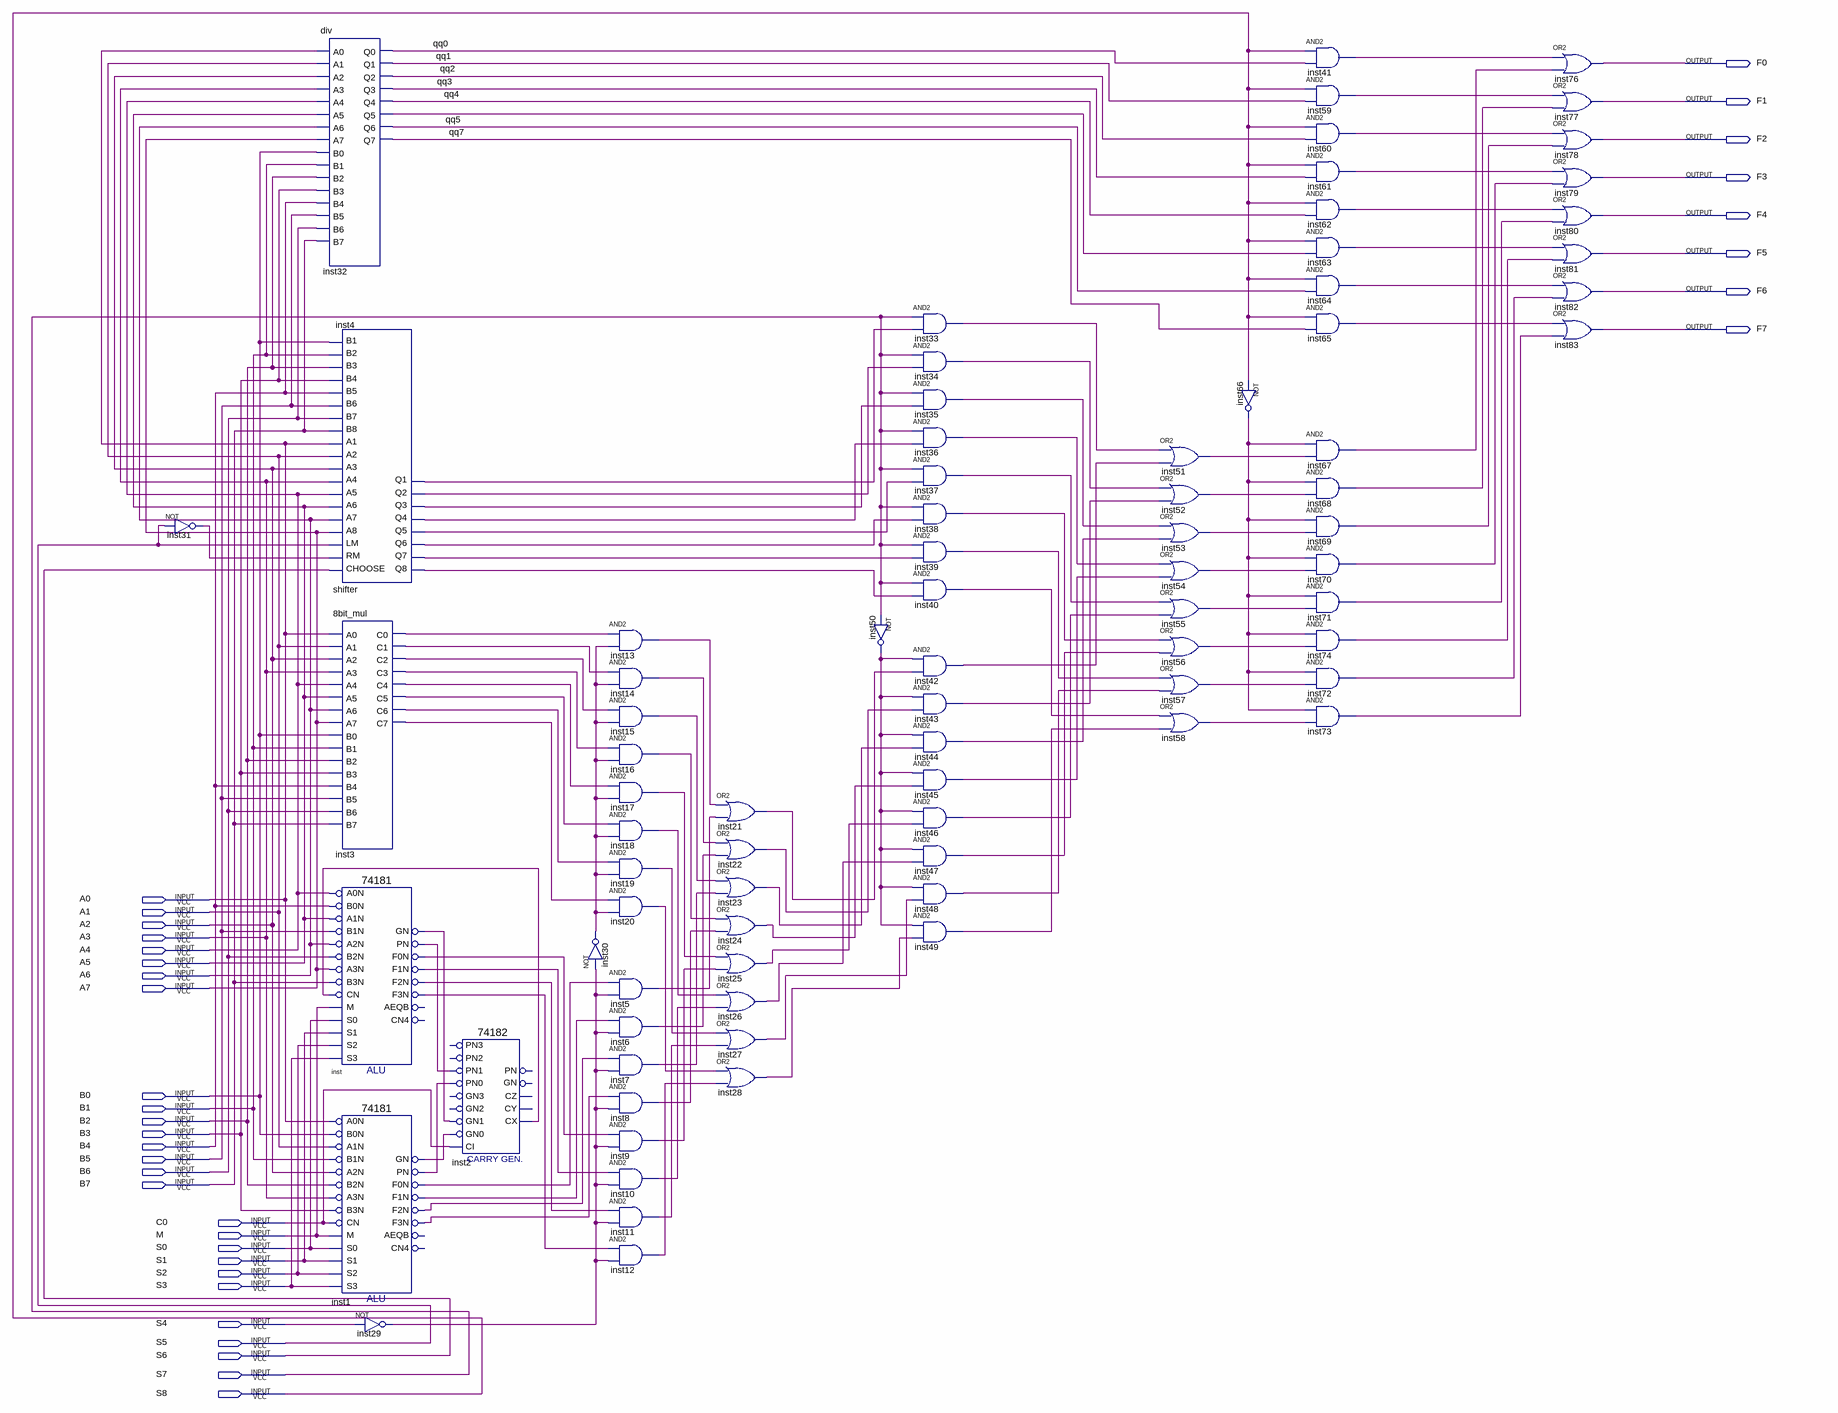
[diagram p0: schematic sheet]
// Quartus schematic ALUnew.bdf as structural Verilog: 83 symbols, 35 pins
module ALUnew (
  input  A0,
  input  A1,
  input  A2,
  input  A3,
  input  A4,
  input  A5,
  input  A6,
  input  A7,
  input  B0,
  input  B1,
  input  B2,
  input  B3,
  input  B4,
  input  B5,
  input  B6,
  input  B7,
  input  C0,
  input  M,
  input  S0,
  input  S1,
  input  S2,
  input  S3,
  input  S4,
  input  S5,
  input  S6,
  input  S7,
  input  S8,
  output F0,
  output F1,
  output F2,
  output F3,
  output F4,
  output F5,
  output F6,
  output F7
);

  wire inst1_f0n, inst1_f1n, inst1_f2n, inst1_f3n, inst1_gn, inst1_pn, inst2_cx, inst3_c0, inst3_c1,
       inst3_c2, inst3_c3, inst3_c4, inst3_c5, inst3_c6, inst3_c7, inst4_q1, inst4_q2, inst4_q3, inst4_q4,
       inst4_q5, inst4_q6, inst4_q7, inst4_q8, inst5_out, inst6_out, inst7_out, inst8_out, inst9_out,
       inst10_out, inst11_out, inst12_out, inst13_out, inst14_out, inst15_out, inst16_out, inst17_out,
       inst18_out, inst19_out, inst20_out, inst21_out, inst22_out, inst23_out, inst24_out, inst25_out,
       inst26_out, inst27_out, inst28_out, inst29_out, inst30_out, inst31_out, inst32_q5, inst33_out,
       inst34_out, inst35_out, inst36_out, inst37_out, inst38_out, inst39_out, inst40_out, inst41_out,
       inst42_out, inst43_out, inst44_out, inst45_out, inst46_out, inst47_out, inst48_out, inst49_out,
       inst50_out, inst51_out, inst52_out, inst53_out, inst54_out, inst55_out, inst56_out, inst57_out,
       inst58_out, inst59_out, inst60_out, inst61_out, inst62_out, inst63_out, inst64_out, inst65_out,
       inst66_out, inst67_out, inst68_out, inst69_out, inst70_out, inst71_out, inst72_out, inst73_out,
       inst74_out, inst_f0n, inst_f1n, inst_f2n, inst_f3n, inst_gn, inst_pn, qq0, qq1, qq2, qq3, qq4, qq5,
       qq7;

  not inst31 (inst31_out, S5);
  div inst32 (
    .A0(A0), .A1(A1), .A2(A2), .A3(A3), .A4(A4), .A5(A5), .A6(A6), .A7(A7), .B0(B0), .B1(B1), .B2(B2),
    .B3(B3), .B4(B4), .B5(B5), .B6(B6), .B7(B7), .Q0(qq0), .Q1(qq1), .Q2(qq2), .Q3(qq3), .Q4(qq4),
    .Q5(inst32_q5), .Q6(qq5), .Q7(qq7));
  shifter inst4 (
    .CHOOSE(S6), .RM(inst31_out), .LM(S5), .A8(A7), .A7(A6), .A6(A5), .A5(A4), .A4(A3), .A3(A2), .A2(A1),
    .A1(A0), .B8(B7), .B7(B6), .B6(B5), .B5(B4), .B4(B3), .B3(B2), .B2(B1), .B1(B0), .Q8(inst4_q8),
    .Q7(inst4_q7), .Q6(inst4_q6), .Q5(inst4_q5), .Q4(inst4_q4), .Q3(inst4_q3), .Q2(inst4_q2), .Q1(inst4_q1));
  \8bit_mul  inst3 (
    .A0(A0), .A1(A1), .A2(A2), .A3(A3), .A4(A4), .A5(A5), .A6(A6), .A7(A7), .B0(B0), .B1(B1), .B2(B2),
    .B3(B3), .B4(B4), .B5(B5), .B6(B6), .B7(B7), .C0(inst3_c0), .C1(inst3_c1), .C2(inst3_c2), .C3(inst3_c3),
    .C4(inst3_c4), .C5(inst3_c5), .C6(inst3_c6), .C7(inst3_c7));
  \74181  inst (
    .B0N(B4), .A0N(A4), .A1N(A5), .B1N(B5), .A3N(A7), .B2N(B6), .A2N(A6), .M(M), .CN(inst2_cx), .B3N(B7),
    .S2(S2), .S1(S1), .S0(S0), .S3(S3), .PN(inst_pn), .GN(inst_gn), .F3N(inst_f3n), .F1N(inst_f1n),
    .F0N(inst_f0n), .F2N(inst_f2n));  // open: AEQB, CN4
  \74181  inst1 (
    .B0N(B0), .A0N(A0), .A1N(A1), .B1N(B1), .A3N(A3), .B2N(B2), .A2N(A2), .M(M), .CN(C0), .B3N(B3), .S2(S2),
    .S1(S1), .S0(S0), .S3(S3), .PN(inst1_pn), .GN(inst1_gn), .F3N(inst1_f3n), .F1N(inst1_f1n),
    .F0N(inst1_f0n), .F2N(inst1_f2n));  // open: AEQB, CN4
  not inst29 (inst29_out, S4);
  \74182  inst2 (
    .CI(C0), .PN1(inst_pn), .PN0(inst1_pn), .GN1(inst_gn), .GN0(inst1_gn), .CX(inst2_cx));  // open: PN2, GN2, GN3, PN3, CY, PN, CZ, GN
  and inst13 (inst13_out, inst3_c0, inst30_out);
  and inst14 (inst14_out, inst3_c1, inst30_out);
  and inst15 (inst15_out, inst3_c2, inst30_out);
  and inst16 (inst16_out, inst3_c3, inst30_out);
  and inst17 (inst17_out, inst3_c4, inst30_out);
  and inst18 (inst18_out, inst3_c5, inst30_out);
  and inst19 (inst19_out, inst3_c6, inst30_out);
  and inst20 (inst20_out, inst3_c7, inst30_out);
  not inst30 (inst30_out, inst29_out);
  and inst5 (inst5_out, inst1_f0n, inst29_out);
  and inst6 (inst6_out, inst1_f1n, inst29_out);
  and inst7 (inst7_out, inst1_f2n, inst29_out);
  and inst8 (inst8_out, inst1_f3n, inst29_out);
  and inst9 (inst9_out, inst_f0n, inst29_out);
  and inst10 (inst10_out, inst_f1n, inst29_out);
  and inst11 (inst11_out, inst_f2n, inst29_out);
  and inst12 (inst12_out, inst_f3n, inst29_out);
  or inst21 (inst21_out, inst13_out, inst5_out);
  or inst22 (inst22_out, inst14_out, inst6_out);
  or inst23 (inst23_out, inst15_out, inst7_out);
  or inst24 (inst24_out, inst16_out, inst8_out);
  or inst25 (inst25_out, inst17_out, inst9_out);
  or inst26 (inst26_out, inst18_out, inst10_out);
  or inst27 (inst27_out, inst19_out, inst11_out);
  or inst28 (inst28_out, inst20_out, inst12_out);
  not inst50 (inst50_out, S7);
  and inst33 (inst33_out, S7, inst4_q1);
  and inst34 (inst34_out, S7, inst4_q2);
  and inst35 (inst35_out, S7, inst4_q3);
  and inst36 (inst36_out, S7, inst4_q4);
  and inst37 (inst37_out, S7, inst4_q5);
  and inst38 (inst38_out, S7, inst4_q6);
  and inst39 (inst39_out, S7, inst4_q7);
  and inst40 (inst40_out, S7, inst4_q8);
  and inst42 (inst42_out, inst50_out, inst21_out);
  and inst43 (inst43_out, inst50_out, inst22_out);
  and inst44 (inst44_out, inst50_out, inst23_out);
  and inst45 (inst45_out, inst50_out, inst24_out);
  and inst46 (inst46_out, inst50_out, inst25_out);
  and inst47 (inst47_out, inst50_out, inst26_out);
  and inst48 (inst48_out, inst50_out, inst27_out);
  and inst49 (inst49_out, inst50_out, inst28_out);
  or inst51 (inst51_out, inst33_out, inst42_out);
  or inst52 (inst52_out, inst34_out, inst43_out);
  or inst53 (inst53_out, inst35_out, inst44_out);
  or inst54 (inst54_out, inst36_out, inst45_out);
  or inst55 (inst55_out, inst37_out, inst46_out);
  or inst56 (inst56_out, inst38_out, inst47_out);
  or inst57 (inst57_out, inst39_out, inst48_out);
  or inst58 (inst58_out, inst40_out, inst49_out);
  not inst66 (inst66_out, S8);
  and inst41 (inst41_out, S8, qq0);
  and inst59 (inst59_out, S8, qq1);
  and inst60 (inst60_out, S8, qq2);
  and inst61 (inst61_out, S8, qq3);
  and inst62 (inst62_out, S8, qq4);
  and inst63 (inst63_out, S8, inst32_q5);
  and inst64 (inst64_out, S8, qq5);
  and inst65 (inst65_out, S8, qq7);
  and inst67 (inst67_out, inst66_out, inst51_out);
  and inst68 (inst68_out, inst66_out, inst52_out);
  and inst69 (inst69_out, inst66_out, inst53_out);
  and inst70 (inst70_out, inst66_out, inst54_out);
  and inst71 (inst71_out, inst66_out, inst55_out);
  and inst74 (inst74_out, inst66_out, inst56_out);
  and inst72 (inst72_out, inst66_out, inst57_out);
  and inst73 (inst73_out, inst66_out, inst58_out);
  or inst76 (F0, inst41_out, inst67_out);
  or inst77 (F1, inst59_out, inst68_out);
  or inst78 (F2, inst60_out, inst69_out);
  or inst79 (F3, inst61_out, inst70_out);
  or inst80 (F4, inst62_out, inst71_out);
  or inst81 (F5, inst63_out, inst74_out);
  or inst82 (F6, inst64_out, inst72_out);
  or inst83 (F7, inst65_out, inst73_out);
endmodule
